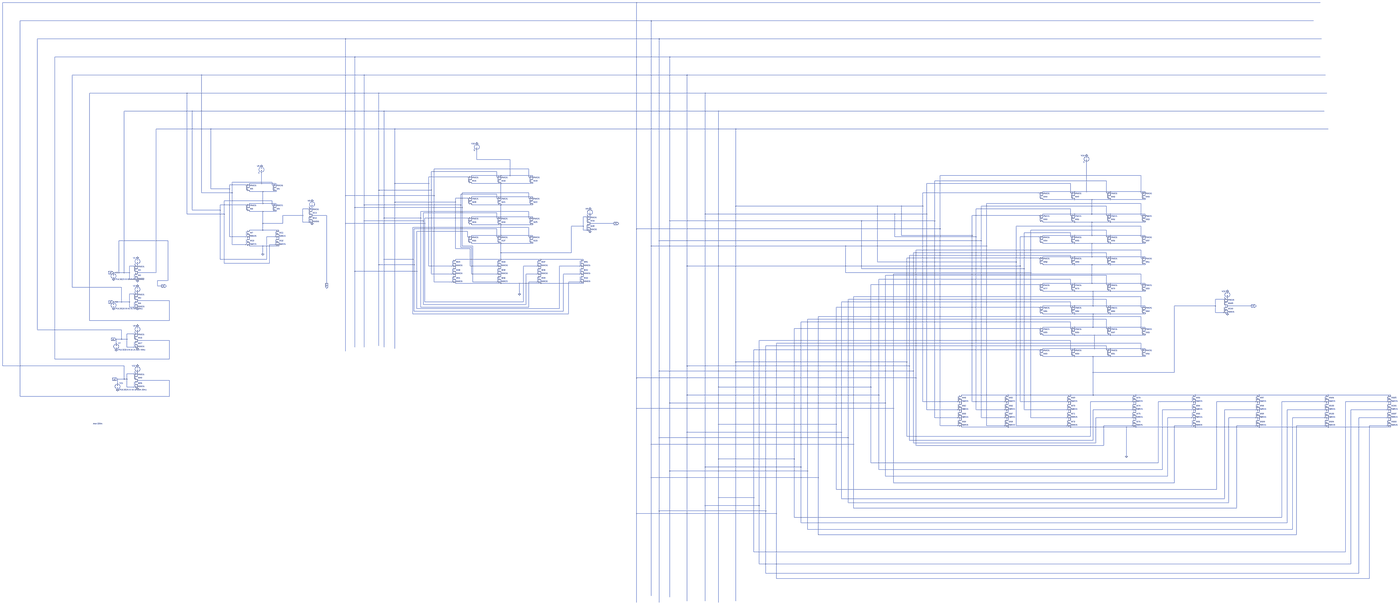
[diagram p0: schematic final using AND,OR.asc, whole sheet]
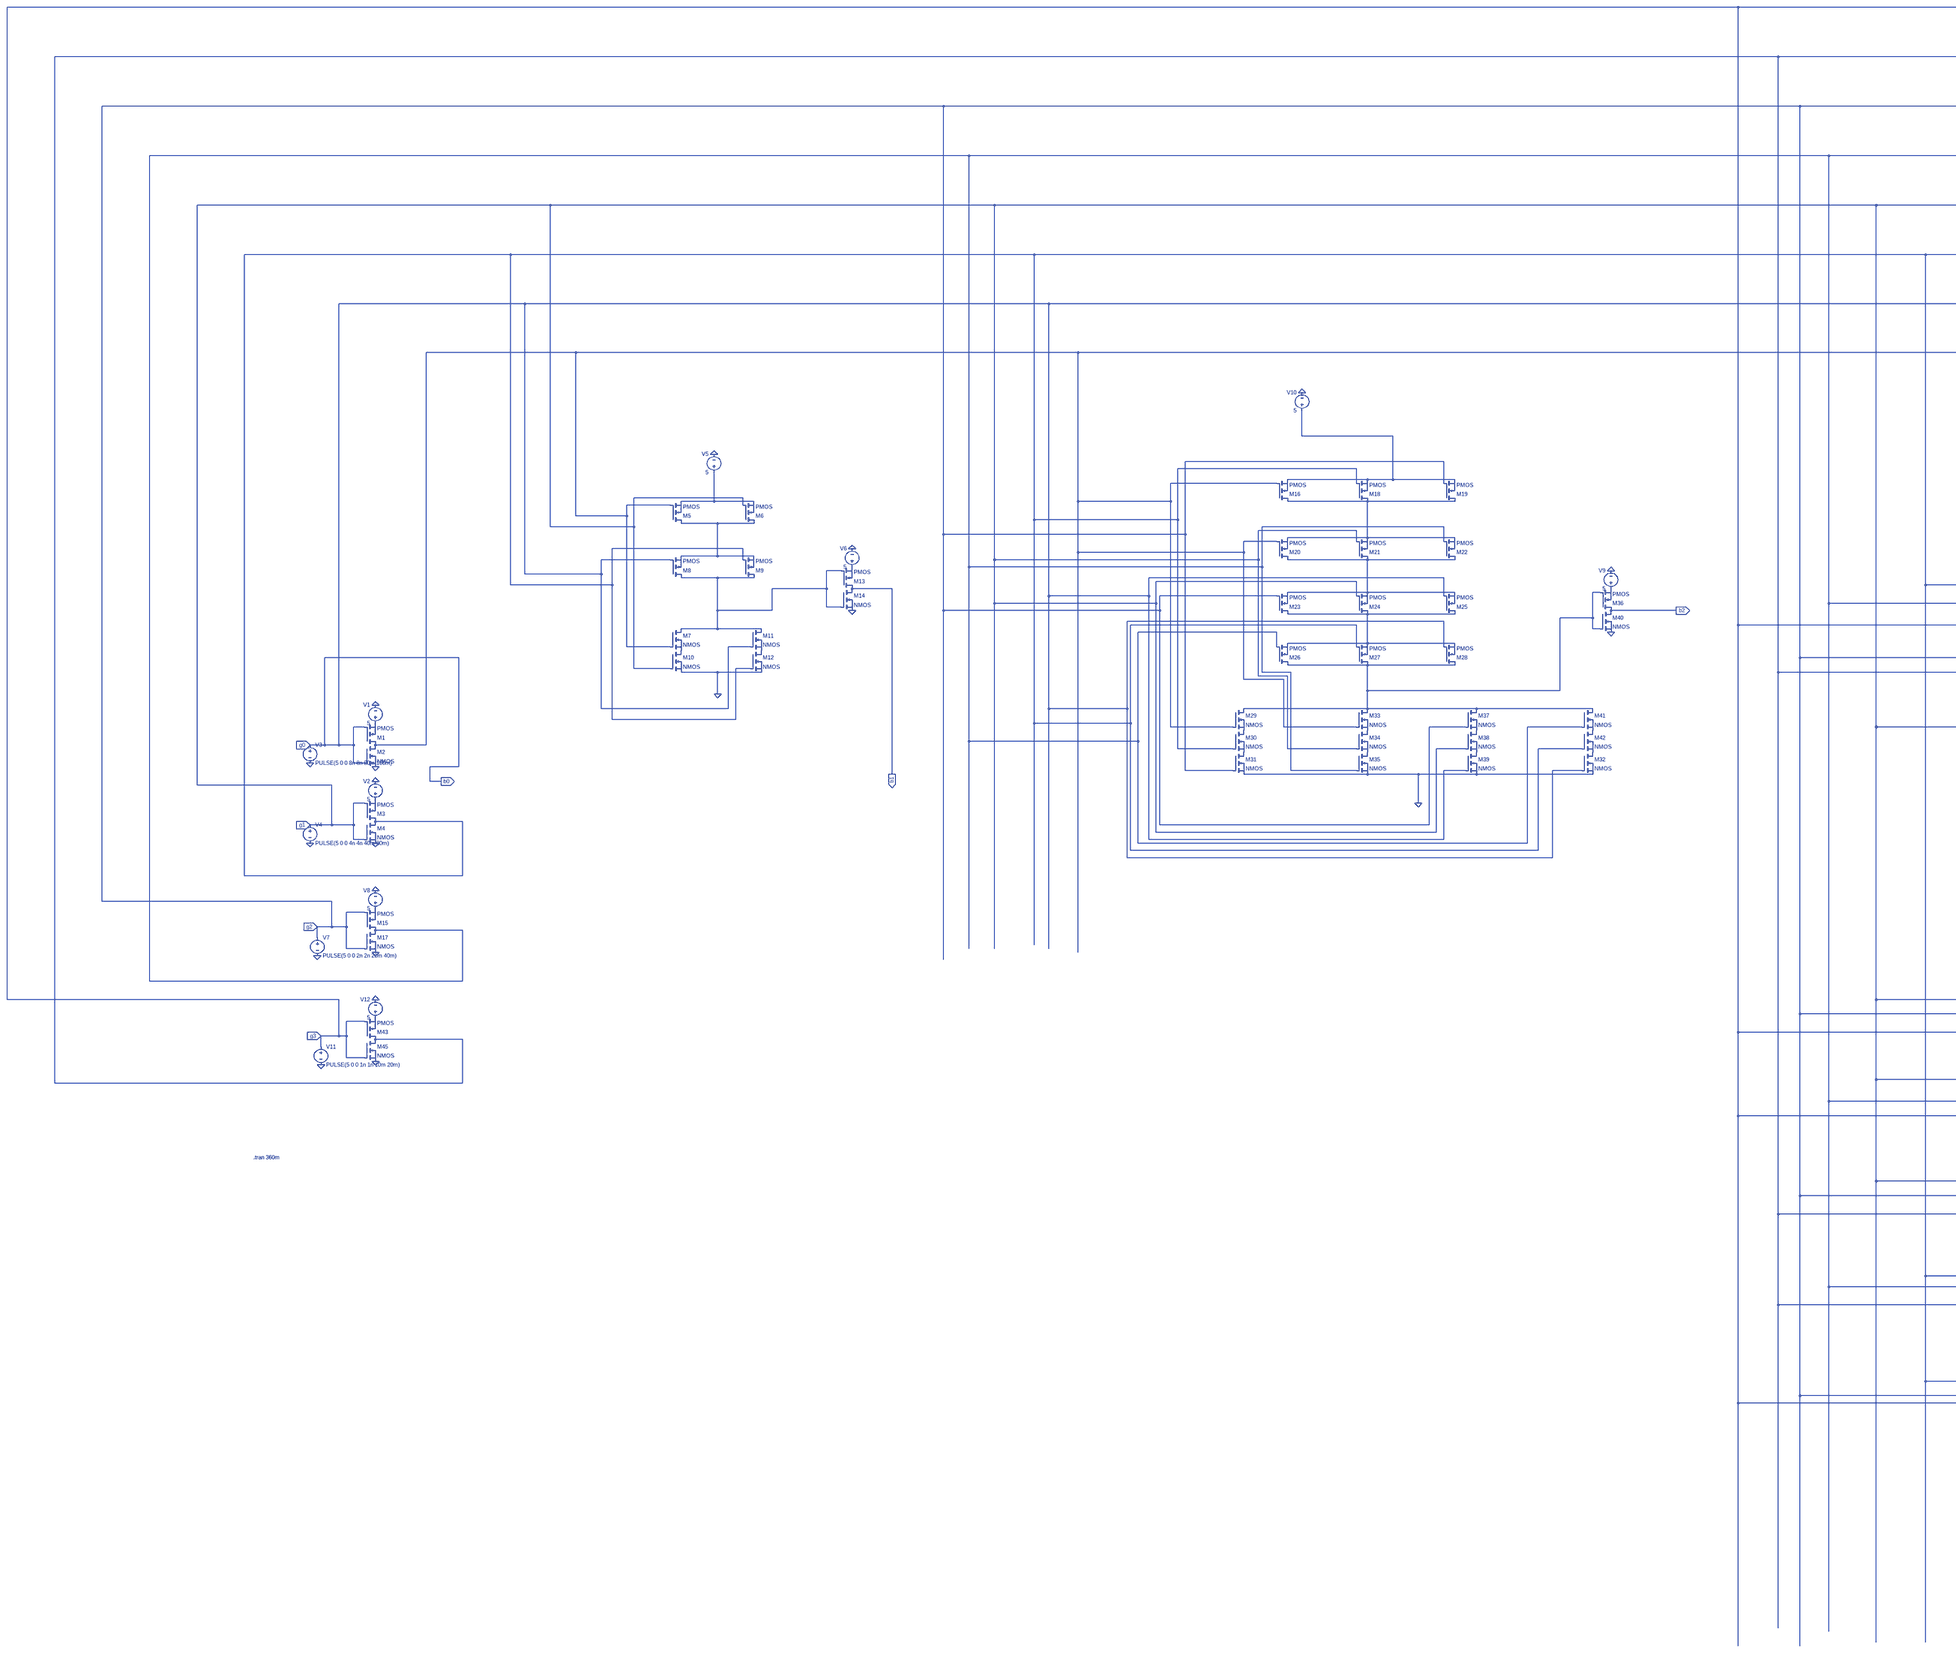
[diagram p1: schematic final using AND,OR.asc, part, row 1 of 1, column 1 of 2]
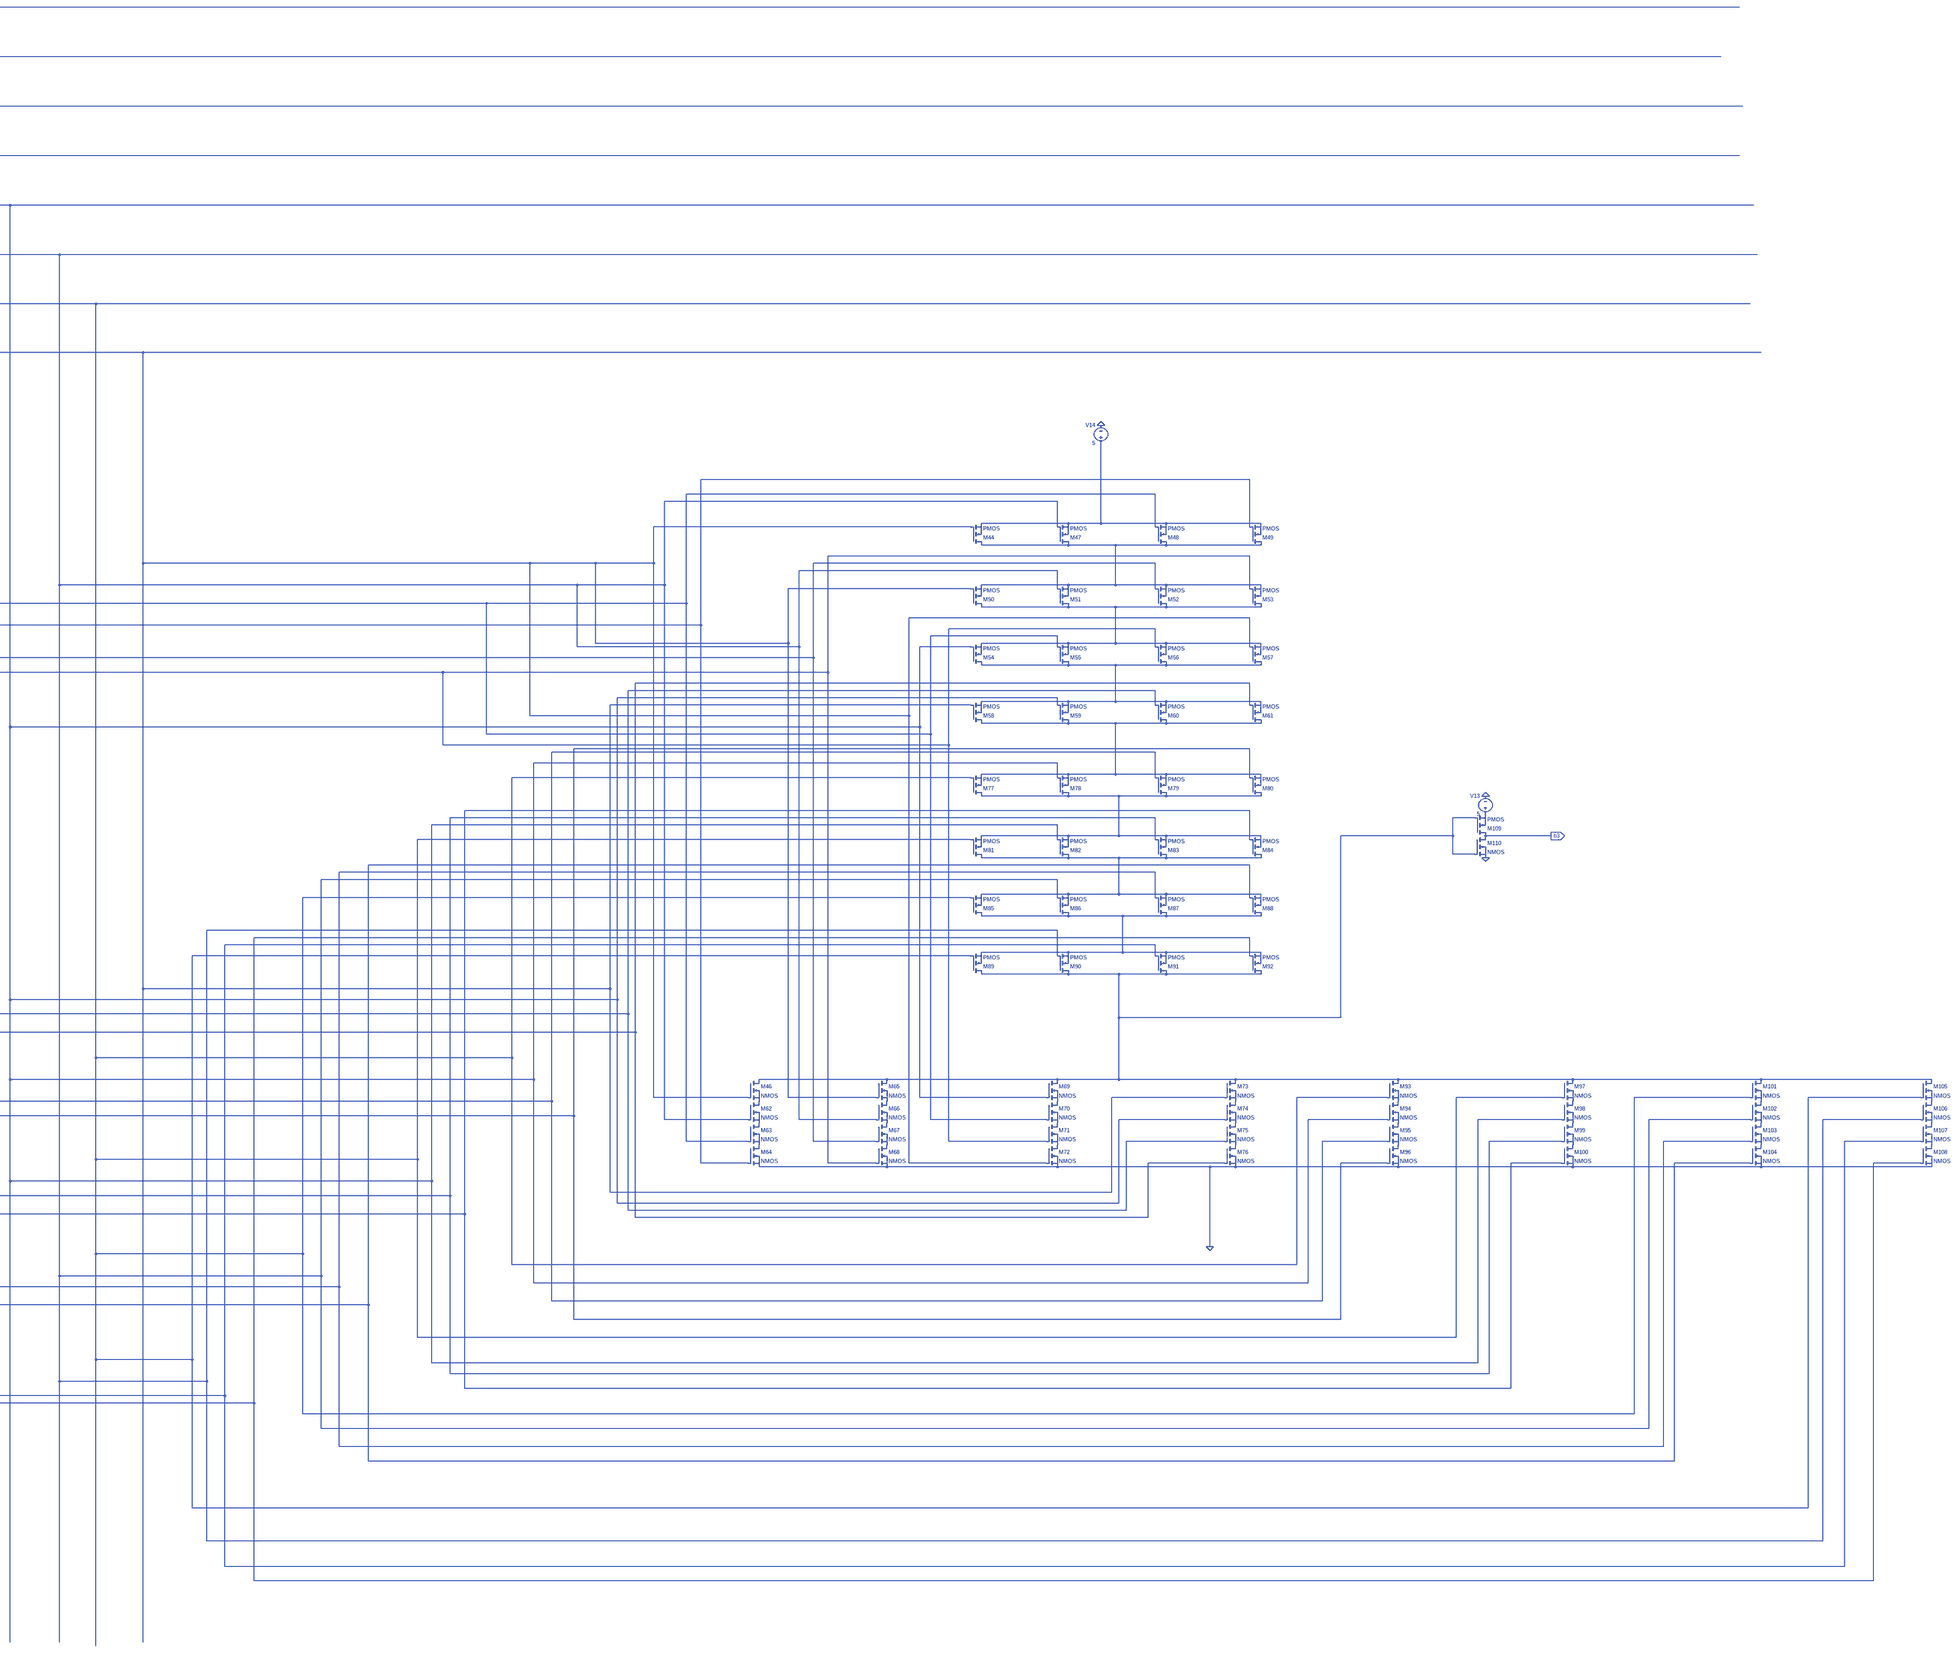
[diagram p2: schematic final using AND,OR.asc, part, row 1 of 1, column 2 of 2]
final using AND,OR.asc, the LTspice schematic file:
Version 4
SHEET 1 18052 4724
WIRE 6912 -4256 -2224 -4256
WIRE 16032 -4256 6912 -4256
WIRE 7088 -3936 -1968 -3936
WIRE 15952 -3936 7088 -3936
WIRE 2816 -3424 -1648 -3424
WIRE 7184 -3424 2816 -3424
WIRE 16048 -3424 7184 -3424
WIRE 2928 -3104 -1408 -3104
WIRE 7312 -3104 2928 -3104
WIRE 16032 -3104 7312 -3104
WIRE 752 -2688 -1136 -2688
WIRE 3040 -2688 752 -2688
WIRE 7520 -2688 3040 -2688
WIRE 16096 -2688 7520 -2688
WIRE 576 -2288 -928 -2288
WIRE 3216 -2288 576 -2288
WIRE 7744 -2288 3216 -2288
WIRE 16112 -2288 7744 -2288
WIRE 640 -1920 -512 -1920
WIRE 3280 -1920 640 -1920
WIRE 7904 -1920 3280 -1920
WIRE 16080 -1920 7904 -1920
WIRE 864 -1680 -128 -1680
WIRE 3408 -1680 864 -1680
WIRE 8112 -1680 3408 -1680
WIRE 16128 -1680 8112 -1680
WIRE 4576 -1312 4576 -1424
WIRE 4976 -1312 4576 -1312
WIRE 5200 -1200 4032 -1200
WIRE 4816 -1168 4000 -1168
WIRE 4864 -1120 4512 -1120
WIRE 4976 -1120 4976 -1312
WIRE 4976 -1120 4864 -1120
WIRE 5248 -1120 4976 -1120
WIRE 13776 -1120 11072 -1120
WIRE 4464 -1104 3968 -1104
WIRE 4816 -1104 4816 -1168
WIRE 5200 -1104 5200 -1200
WIRE 13360 -1056 11008 -1056
WIRE 1600 -1040 1120 -1040
WIRE 1472 -1024 1472 -1152
WIRE 1472 -1024 1328 -1024
WIRE 1648 -1024 1472 -1024
WIRE 3408 -1024 3408 -1680
WIRE 3968 -1024 3968 -1104
WIRE 3968 -1024 3408 -1024
WIRE 4864 -1024 4512 -1024
WIRE 5248 -1024 4864 -1024
WIRE 12928 -1024 10912 -1024
WIRE 1280 -1008 1088 -1008
WIRE 1600 -1008 1600 -1040
WIRE 864 -960 864 -1680
WIRE 1088 -960 1088 -1008
WIRE 1088 -960 864 -960
WIRE 3216 -944 3216 -2288
WIRE 4000 -944 4000 -1168
WIRE 4000 -944 3216 -944
WIRE 1488 -928 1328 -928
WIRE 1648 -928 1488 -928
WIRE 12976 -928 12512 -928
WIRE 13120 -928 13120 -1280
WIRE 13120 -928 12976 -928
WIRE 13408 -928 13120 -928
WIRE 13824 -928 13408 -928
WIRE 752 -912 752 -2688
WIRE 1120 -912 1120 -1040
WIRE 1120 -912 752 -912
WIRE 5200 -912 4400 -912
WIRE 12464 -912 10864 -912
WIRE 12928 -912 12928 -1024
WIRE 13360 -912 13360 -1056
WIRE 13776 -912 13776 -1120
WIRE 4816 -896 4384 -896
WIRE 2816 -880 2816 -3424
WIRE 4032 -880 4032 -1200
WIRE 4032 -880 2816 -880
WIRE 4864 -864 4864 -1024
WIRE 4864 -864 4512 -864
WIRE 5248 -864 4864 -864
WIRE 4464 -848 4320 -848
WIRE 4816 -848 4816 -896
WIRE 5200 -848 5200 -912
WIRE 12976 -832 12512 -832
WIRE 13184 -832 12976 -832
WIRE 13408 -832 13184 -832
WIRE 13824 -832 13408 -832
WIRE 1600 -816 1024 -816
WIRE 3408 -800 3408 -1024
WIRE 4320 -800 4320 -848
WIRE 4320 -800 3408 -800
WIRE 1488 -784 1488 -928
WIRE 1488 -784 1328 -784
WIRE 1648 -784 1488 -784
WIRE 13776 -784 11632 -784
WIRE 1280 -768 976 -768
WIRE 1600 -768 1600 -816
WIRE 3040 -768 3040 -2688
WIRE 4384 -768 4384 -896
WIRE 4384 -768 3040 -768
WIRE 4864 -768 4512 -768
WIRE 5248 -768 4864 -768
WIRE 8112 -752 8112 -1680
WIRE 10320 -752 8112 -752
WIRE 10608 -752 10320 -752
WIRE 10864 -752 10864 -912
WIRE 10864 -752 10608 -752
WIRE 13360 -752 11568 -752
WIRE 2928 -736 2928 -3104
WIRE 4400 -736 4400 -912
WIRE 4400 -736 2928 -736
WIRE 2032 -720 1968 -720
WIRE 12928 -720 11504 -720
WIRE 640 -704 640 -1920
WIRE 976 -704 976 -768
WIRE 976 -704 640 -704
WIRE 1488 -688 1328 -688
WIRE 1648 -688 1488 -688
WIRE 5200 -688 3872 -688
WIRE 4816 -672 3904 -672
WIRE 576 -656 576 -2288
WIRE 1024 -656 1024 -816
WIRE 1024 -656 576 -656
WIRE 7744 -656 7744 -2288
WIRE 10528 -656 7744 -656
WIRE 10912 -656 10912 -1024
WIRE 10912 -656 10528 -656
WIRE 12976 -656 12512 -656
WIRE 13184 -656 13184 -832
WIRE 13184 -656 12976 -656
WIRE 13408 -656 13184 -656
WIRE 13824 -656 13408 -656
WIRE 1968 -640 1968 -720
WIRE 1968 -640 1728 -640
WIRE 2256 -640 2080 -640
WIRE 12464 -640 11456 -640
WIRE 12928 -640 12928 -720
WIRE 13360 -640 13360 -752
WIRE 13776 -640 13776 -784
WIRE 4864 -624 4864 -768
WIRE 4864 -624 4512 -624
WIRE 5248 -624 4864 -624
WIRE 5888 -624 5856 -624
WIRE 3280 -608 3280 -1920
WIRE 3872 -608 3872 -688
WIRE 3872 -608 3280 -608
WIRE 4464 -608 3920 -608
WIRE 4816 -608 4816 -672
WIRE 5200 -608 5200 -688
WIRE 3040 -576 3040 -768
WIRE 3904 -576 3904 -672
WIRE 3904 -576 3040 -576
WIRE 7312 -576 7312 -3104
WIRE 10128 -576 7312 -576
WIRE 11008 -576 11008 -1056
WIRE 11008 -576 10128 -576
WIRE 1968 -560 1968 -640
WIRE 2032 -560 1968 -560
WIRE 12976 -560 12512 -560
WIRE 13184 -560 12976 -560
WIRE 13408 -560 13184 -560
WIRE 13824 -560 13408 -560
WIRE 1488 -544 1488 -688
WIRE 1728 -544 1728 -640
WIRE 1728 -544 1488 -544
WIRE 2816 -544 2816 -880
WIRE 3920 -544 3920 -608
WIRE 3920 -544 2816 -544
WIRE 6480 -544 5936 -544
WIRE 4864 -528 4512 -528
WIRE 5248 -528 4864 -528
WIRE 5856 -512 5856 -624
WIRE 5856 -512 5712 -512
WIRE 13776 -512 12192 -512
WIRE 5200 -496 3776 -496
WIRE 4816 -480 3792 -480
WIRE 6912 -480 6912 -4256
WIRE 11072 -480 11072 -1120
WIRE 11072 -480 6912 -480
WIRE 1488 -464 1488 -544
WIRE 1488 -464 1328 -464
WIRE 1680 -464 1488 -464
WIRE 5856 -464 5856 -512
WIRE 5888 -464 5856 -464
WIRE 13360 -464 12368 -464
WIRE 4464 -448 3824 -448
WIRE 12928 -432 12288 -432
WIRE 4864 -400 4864 -528
WIRE 4864 -400 4512 -400
WIRE 5248 -400 4864 -400
WIRE 10608 -400 10608 -752
WIRE 11456 -400 11456 -640
WIRE 11456 -400 10608 -400
WIRE 12976 -400 12512 -400
WIRE 13184 -400 13184 -560
WIRE 13184 -400 12976 -400
WIRE 13408 -400 13184 -400
WIRE 13824 -400 13408 -400
WIRE 1088 -384 1088 -960
WIRE 1280 -384 1088 -384
WIRE 1632 -384 1536 -384
WIRE 4464 -384 4464 -448
WIRE 4816 -384 4816 -480
WIRE 5200 -384 5200 -496
WIRE 10528 -384 10528 -656
WIRE 11504 -384 11504 -720
WIRE 11504 -384 10528 -384
WIRE 12464 -384 12240 -384
WIRE 12928 -384 12928 -432
WIRE 13360 -384 13360 -464
WIRE 13776 -384 13776 -512
WIRE 16 -336 -576 -336
WIRE 7184 -336 7184 -3424
WIRE 11568 -336 11568 -752
WIRE 11568 -336 7184 -336
WIRE 4864 -304 4512 -304
WIRE 5248 -304 4864 -304
WIRE 12976 -304 12512 -304
WIRE 13184 -304 12976 -304
WIRE 13408 -304 13184 -304
WIRE 13824 -304 13408 -304
WIRE 1120 -288 1120 -912
WIRE 1280 -288 1120 -288
WIRE 1632 -288 1568 -288
WIRE 1488 -272 1328 -272
WIRE 1680 -272 1488 -272
WIRE 4400 -272 4400 -736
WIRE 4528 -272 4400 -272
WIRE 7088 -272 7088 -3936
WIRE 9936 -272 7088 -272
WIRE 11632 -272 11632 -784
WIRE 11632 -272 9936 -272
WIRE 4384 -256 4384 -768
WIRE 4512 -256 4384 -256
WIRE 4320 -240 4320 -800
WIRE 4496 -240 4320 -240
WIRE 13776 -224 10784 -224
WIRE 4864 -192 4864 -304
WIRE 5712 -192 5712 -512
WIRE 5712 -192 4864 -192
WIRE 13360 -192 10752 -192
WIRE 1488 -176 1488 -272
WIRE 12928 -160 10704 -160
WIRE 12976 -144 12512 -144
WIRE 13184 -144 13184 -304
WIRE 13184 -144 12976 -144
WIRE 13408 -144 13184 -144
WIRE 13824 -144 13408 -144
WIRE 12464 -128 10672 -128
WIRE 12928 -128 12928 -160
WIRE 13360 -128 13360 -192
WIRE 13776 -128 13776 -224
WIRE 976 -112 976 -704
WIRE 1536 -112 1536 -384
WIRE 1536 -112 976 -112
WIRE 3280 -112 3280 -608
WIRE 3776 -112 3776 -496
WIRE 3776 -112 3280 -112
WIRE 4864 -112 4864 -192
WIRE 4864 -112 4320 -112
WIRE 5344 -112 4864 -112
WIRE 5856 -112 5344 -112
WIRE 10320 -80 10320 -752
WIRE 12192 -80 12192 -512
WIRE 12192 -80 10320 -80
WIRE 1024 -64 1024 -656
WIRE 1568 -64 1568 -288
WIRE 1568 -64 1024 -64
WIRE 3216 -48 3216 -944
WIRE 3792 -48 3792 -480
WIRE 3792 -48 3216 -48
WIRE 12976 -48 12512 -48
WIRE 13184 -48 12976 -48
WIRE 13408 -48 13184 -48
WIRE 13824 -48 13408 -48
WIRE -400 -32 -448 -32
WIRE 3968 -32 3968 -1024
WIRE 4272 -32 3968 -32
WIRE 4496 -32 4496 -240
WIRE 4816 -32 4496 -32
WIRE 5296 -32 5136 -32
WIRE 5808 -32 5568 -32
WIRE 7520 -32 7520 -2688
WIRE 12240 -32 12240 -384
WIRE 12240 -32 7520 -32
WIRE 10128 0 10128 -576
WIRE 12288 0 12288 -432
WIRE 12288 0 10128 0
WIRE 2928 32 2928 -736
WIRE 3824 32 3824 -448
WIRE 3824 32 2928 32
WIRE -576 48 -576 -336
WIRE -576 48 -640 48
WIRE -512 48 -512 -1920
WIRE -512 48 -576 48
WIRE -448 48 -448 -32
WIRE -448 48 -512 48
WIRE -128 48 -128 -1680
WIRE -128 48 -352 48
WIRE 9936 48 9936 -272
WIRE 12368 48 12368 -464
WIRE 12368 48 9936 48
WIRE 4000 64 4000 -944
WIRE 4272 64 4000 64
WIRE 4512 64 4512 -256
WIRE 4816 64 4512 64
WIRE 5296 64 5168 64
WIRE 5808 64 5616 64
WIRE 13776 64 10512 64
WIRE 13360 80 10416 80
WIRE -448 128 -448 48
WIRE -400 128 -448 128
WIRE 12928 128 10336 128
WIRE 16 144 16 -336
WIRE 16 144 -112 144
WIRE 4032 160 4032 -880
WIRE 4272 160 4032 160
WIRE 4528 160 4528 -272
WIRE 4816 160 4528 160
WIRE 5296 160 5200 160
WIRE 5808 160 5680 160
WIRE 2256 176 2256 -640
WIRE 4864 176 4320 176
WIRE 5088 176 4864 176
WIRE 5344 176 5088 176
WIRE 5856 176 5344 176
WIRE 12976 176 12512 176
WIRE 13184 176 13184 -48
WIRE 13184 176 12976 176
WIRE 13408 176 13184 176
WIRE 13824 176 13408 176
WIRE 12464 192 10240 192
WIRE 12928 192 12928 128
WIRE 13360 192 13360 80
WIRE 13776 192 13776 64
WIRE -112 208 -112 144
WIRE -64 208 -112 208
WIRE -1136 224 -1136 -2688
WIRE -544 224 -1136 224
WIRE 12976 272 12512 272
WIRE 13200 272 12976 272
WIRE 13408 272 13200 272
WIRE 13824 272 13408 272
WIRE -400 304 -448 304
WIRE 5088 304 5088 176
WIRE 13776 336 10032 336
WIRE 13360 368 9968 368
WIRE 14864 368 14768 368
WIRE 32 384 -352 384
WIRE -544 400 -544 224
WIRE -544 400 -640 400
WIRE -448 400 -448 304
WIRE -448 400 -544 400
WIRE 3920 400 3920 -544
WIRE 5136 400 5136 -32
WIRE 5136 400 3920 400
WIRE 12928 400 9888 400
WIRE 3904 432 3904 -576
WIRE 5168 432 5168 64
WIRE 5168 432 3904 432
WIRE 12976 448 12512 448
WIRE 13200 448 13200 272
WIRE 13200 448 12976 448
WIRE 13408 448 13200 448
WIRE 13824 448 13408 448
WIRE 14768 448 14768 368
WIRE 14768 448 14176 448
WIRE 15200 448 14912 448
WIRE -448 464 -448 400
WIRE -400 464 -448 464
WIRE 3872 464 3872 -608
WIRE 5200 464 5200 160
WIRE 5200 464 3872 464
WIRE 12464 464 9824 464
WIRE 12928 464 12928 400
WIRE 13360 464 13360 368
WIRE 13776 464 13776 336
WIRE 3824 480 3824 32
WIRE 5568 480 5568 -32
WIRE 5568 480 3824 480
WIRE 3792 512 3792 -48
WIRE 5616 512 5616 64
WIRE 5616 512 3792 512
WIRE 14768 528 14768 448
WIRE 14864 528 14768 528
WIRE 3776 544 3776 -112
WIRE 5680 544 5680 160
WIRE 5680 544 3776 544
WIRE 12976 544 12512 544
WIRE 13200 544 12976 544
WIRE 13408 544 13200 544
WIRE 13824 544 13408 544
WIRE 13776 576 9456 576
WIRE 13360 608 9328 608
WIRE -928 624 -928 -2288
WIRE 32 624 32 384
WIRE 32 624 -928 624
WIRE 12928 640 9248 640
WIRE 12976 704 12512 704
WIRE 13200 704 13200 544
WIRE 13200 704 12976 704
WIRE 13408 704 13200 704
WIRE 13824 704 13408 704
WIRE 12464 720 9168 720
WIRE 12928 720 12928 640
WIRE 13360 720 13360 608
WIRE 13776 720 13776 576
WIRE -1648 736 -1648 -3424
WIRE -544 736 -1648 736
WIRE -400 784 -480 784
WIRE 12976 800 12512 800
WIRE 13216 800 12976 800
WIRE 13408 800 13216 800
WIRE 13824 800 13408 800
WIRE -544 848 -544 736
WIRE -544 848 -608 848
WIRE -480 848 -480 784
WIRE -480 848 -544 848
WIRE 32 864 -352 864
WIRE 12928 864 8656 864
WIRE -608 896 -608 848
WIRE 13776 896 8864 896
WIRE 3216 928 3216 -48
WIRE 13360 928 8736 928
WIRE -480 944 -480 848
WIRE -400 944 -480 944
WIRE 2928 944 2928 32
WIRE 3040 944 3040 -576
WIRE 3280 944 3280 -112
WIRE 3408 960 3408 -800
WIRE 12976 960 12512 960
WIRE 13216 960 13216 800
WIRE 13216 960 12976 960
WIRE 13408 960 13216 960
WIRE 13824 960 13408 960
WIRE 12464 976 8592 976
WIRE 12928 976 12928 864
WIRE 13360 976 13360 928
WIRE 13776 976 13776 896
WIRE 2816 992 2816 -544
WIRE 12976 1056 12512 1056
WIRE 13200 1056 12976 1056
WIRE 13408 1056 13200 1056
WIRE 13824 1056 13408 1056
WIRE -1408 1088 -1408 -3104
WIRE 32 1088 32 864
WIRE 32 1088 -1408 1088
WIRE 8112 1120 8112 -752
WIRE 10672 1120 10672 -128
WIRE 10672 1120 8112 1120
WIRE -2224 1168 -2224 -4256
WIRE -512 1168 -2224 1168
WIRE 7520 1168 7520 -32
WIRE 10704 1168 10704 -160
WIRE 10704 1168 7520 1168
WIRE 7184 1232 7184 -336
WIRE 10752 1232 10752 -192
WIRE 10752 1232 7184 1232
WIRE 13200 1248 13200 1056
WIRE 14176 1248 14176 448
WIRE 14176 1248 13200 1248
WIRE -400 1264 -480 1264
WIRE 6912 1312 6912 -480
WIRE 10784 1312 10784 -224
WIRE 10784 1312 6912 1312
WIRE -512 1328 -512 1168
WIRE -512 1328 -592 1328
WIRE -480 1328 -480 1264
WIRE -480 1328 -512 1328
WIRE 32 1344 -352 1344
WIRE -592 1376 -592 1328
WIRE -480 1424 -480 1328
WIRE -400 1424 -480 1424
WIRE 7904 1424 7904 -1920
WIRE 10240 1424 10240 192
WIRE 10240 1424 7904 1424
WIRE 7520 1520 7520 1168
WIRE 10336 1520 10336 128
WIRE 10336 1520 7520 1520
WIRE 12096 1520 11328 1520
WIRE 12928 1520 12096 1520
WIRE 13200 1520 13200 1248
WIRE 13200 1520 12928 1520
WIRE 13712 1520 13200 1520
WIRE 14528 1520 13712 1520
WIRE 15296 1520 14528 1520
WIRE 16128 1520 15296 1520
WIRE 16912 1520 16128 1520
WIRE -1968 1536 -1968 -3936
WIRE 32 1536 32 1344
WIRE 32 1536 -1968 1536
WIRE 10864 1600 10864 -752
WIRE 11280 1600 10864 1600
WIRE 11456 1600 11456 -400
WIRE 12048 1600 11456 1600
WIRE 12240 1600 12240 -32
WIRE 12880 1600 12240 1600
WIRE 13664 1600 13168 1600
WIRE 14480 1600 13984 1600
WIRE 15248 1600 14784 1600
WIRE 16080 1600 15568 1600
WIRE 16864 1600 16336 1600
WIRE 7312 1616 7312 -576
WIRE 10416 1616 10416 80
WIRE 10416 1616 7312 1616
WIRE 6912 1680 6912 1312
WIRE 10512 1680 10512 64
WIRE 10512 1680 6912 1680
WIRE 10912 1696 10912 -656
WIRE 11280 1696 10912 1696
WIRE 11504 1696 11504 -384
WIRE 12048 1696 11504 1696
WIRE 12288 1696 12288 0
WIRE 12880 1696 12288 1696
WIRE 13664 1696 13200 1696
WIRE 14480 1696 14032 1696
WIRE 15248 1696 14880 1696
WIRE 16080 1696 15632 1696
WIRE 16864 1696 16400 1696
WIRE 11008 1792 11008 -576
WIRE 11280 1792 11008 1792
WIRE 11568 1792 11568 -336
WIRE 12048 1792 11568 1792
WIRE 12368 1792 12368 48
WIRE 12880 1792 12368 1792
WIRE 13664 1792 13232 1792
WIRE 14480 1792 14096 1792
WIRE 15248 1792 14928 1792
WIRE 16080 1792 15696 1792
WIRE 16864 1792 16496 1792
WIRE 7904 1872 7904 1424
WIRE 9824 1872 9824 464
WIRE 9824 1872 7904 1872
WIRE 11072 1888 11072 -480
WIRE 11280 1888 11072 1888
WIRE 11632 1888 11632 -272
WIRE 12048 1888 11632 1888
WIRE 12192 1888 12192 -80
WIRE 12880 1888 12192 1888
WIRE 13664 1888 13328 1888
WIRE 14480 1888 14176 1888
WIRE 15248 1888 15024 1888
WIRE 16080 1888 15744 1888
WIRE 16864 1888 16624 1888
WIRE 12096 1904 11328 1904
WIRE 12928 1904 12096 1904
WIRE 13600 1904 12928 1904
WIRE 13712 1904 13600 1904
WIRE 14528 1904 13712 1904
WIRE 15296 1904 14528 1904
WIRE 16128 1904 15296 1904
WIRE 16912 1904 16128 1904
WIRE 7520 1968 7520 1520
WIRE 9888 1968 9888 400
WIRE 9888 1968 7520 1968
WIRE 10672 2016 10672 1120
WIRE 13168 2016 13168 1600
WIRE 13168 2016 10672 2016
WIRE 7184 2032 7184 1232
WIRE 9968 2032 9968 368
WIRE 9968 2032 7184 2032
WIRE 10704 2064 10704 1168
WIRE 13200 2064 13200 1696
WIRE 13200 2064 10704 2064
WIRE 10752 2096 10752 1232
WIRE 13232 2096 13232 1792
WIRE 13232 2096 10752 2096
WIRE 7088 2112 7088 -272
WIRE 10032 2112 10032 336
WIRE 10032 2112 7088 2112
WIRE 10784 2128 10784 1312
WIRE 13328 2128 13328 1888
WIRE 13328 2128 10784 2128
WIRE 13600 2256 13600 1904
WIRE 7904 2288 7904 1872
WIRE 9168 2288 9168 720
WIRE 9168 2288 7904 2288
WIRE 10240 2336 10240 1424
WIRE 13984 2336 13984 1600
WIRE 13984 2336 10240 2336
WIRE 7744 2384 7744 -656
WIRE 9248 2384 9248 640
WIRE 9248 2384 7744 2384
WIRE 10336 2416 10336 1520
WIRE 14032 2416 14032 1696
WIRE 14032 2416 10336 2416
WIRE 7312 2432 7312 1616
WIRE 9328 2432 9328 608
WIRE 9328 2432 7312 2432
WIRE 10416 2496 10416 1616
WIRE 14096 2496 14096 1792
WIRE 14096 2496 10416 2496
WIRE 7088 2512 7088 2112
WIRE 9456 2512 9456 576
WIRE 9456 2512 7088 2512
WIRE 10512 2576 10512 1680
WIRE 14176 2576 14176 1888
WIRE 14176 2576 10512 2576
WIRE 9824 2656 9824 1872
WIRE 14784 2656 14784 1600
WIRE 14784 2656 9824 2656
WIRE 7904 2752 7904 2288
WIRE 8592 2752 8592 976
WIRE 8592 2752 7904 2752
WIRE 9888 2768 9888 1968
WIRE 14880 2768 14880 1696
WIRE 14880 2768 9888 2768
WIRE 9968 2816 9968 2032
WIRE 14928 2816 14928 1792
WIRE 14928 2816 9968 2816
WIRE 7744 2848 7744 2384
WIRE 8656 2848 8656 864
WIRE 8656 2848 7744 2848
WIRE 10032 2880 10032 2112
WIRE 15024 2880 15024 1888
WIRE 15024 2880 10032 2880
WIRE 7184 2912 7184 2032
WIRE 8736 2912 8736 928
WIRE 8736 2912 7184 2912
WIRE 6912 2944 6912 1680
WIRE 8864 2944 8864 896
WIRE 8864 2944 6912 2944
WIRE 9168 2992 9168 2288
WIRE 15568 2992 15568 1600
WIRE 15568 2992 9168 2992
WIRE 9248 3056 9248 2384
WIRE 15632 3056 15632 1696
WIRE 15632 3056 9248 3056
WIRE 9328 3136 9328 2432
WIRE 15696 3136 15696 1792
WIRE 15696 3136 9328 3136
WIRE 9456 3200 9456 2512
WIRE 15744 3200 15744 1888
WIRE 15744 3200 9456 3200
WIRE 8592 3440 8592 2752
WIRE 16336 3440 16336 1600
WIRE 16336 3440 8592 3440
WIRE 8656 3584 8656 2848
WIRE 16400 3584 16400 1696
WIRE 16400 3584 8656 3584
WIRE 8736 3696 8736 2912
WIRE 16496 3696 16496 1792
WIRE 16496 3696 8736 3696
WIRE 8864 3760 8864 2944
WIRE 16624 3760 16624 1888
WIRE 16624 3760 8864 3760
WIRE 7088 4640 7088 2512
WIRE 7312 4656 7312 2432
WIRE 7520 4704 7520 1968
WIRE 7744 4704 7744 2848
WIRE 8112 4704 8112 1120
WIRE 6912 4720 6912 2944
WIRE 7184 4720 7184 2912
WIRE 7904 4720 7904 2752
FLAG -352 144 0
FLAG -352 480 0
FLAG -352 -128 0
FLAG -352 208 0
FLAG -640 128 0
FLAG -640 480 0
FLAG 1488 -176 0
FLAG 2080 -816 0
FLAG 2080 -544 0
FLAG -608 976 0
FLAG -352 688 0
FLAG -352 960 0
FLAG 5088 304 0
FLAG 5936 -448 0
FLAG 5936 -720 0
FLAG -592 1456 0
FLAG -352 1168 0
FLAG -352 1440 0
FLAG 13600 2256 0
FLAG 14912 272 0
FLAG 14912 544 0
FLAG 4576 -1504 0
FLAG 13120 -1360 0
FLAG 1472 -1232 0
FLAG 2256 176 b1
IOPIN 2256 176 Out
FLAG 6480 -544 b2
IOPIN 6480 -544 Out
FLAG 15200 448 b3
IOPIN 15200 448 Out
FLAG -640 48 g0
IOPIN -640 48 In
FLAG -640 400 g1
IOPIN -640 400 In
FLAG -608 848 g2
IOPIN -608 848 In
FLAG -592 1328 g3
IOPIN -592 1328 In
FLAG -64 208 b0
IOPIN -64 208 Out
SYMBOL pmos -400 48 M180
SYMATTR InstName M1
SYMBOL nmos -400 48 R0
SYMATTR InstName M2
SYMBOL pmos -400 384 M180
SYMATTR InstName M3
SYMBOL nmos -400 384 R0
SYMATTR InstName M4
SYMBOL voltage -352 -32 R180
WINDOW 0 24 96 Left 2
WINDOW 3 24 16 Left 2
WINDOW 123 0 0 Left 0
WINDOW 39 0 0 Left 0
SYMATTR InstName V1
SYMATTR Value 5
SYMBOL voltage -352 304 R180
WINDOW 0 24 96 Left 2
WINDOW 3 24 16 Left 2
WINDOW 123 0 0 Left 0
WINDOW 39 0 0 Left 0
SYMATTR InstName V2
SYMATTR Value 5
SYMBOL voltage -640 32 R0
WINDOW 123 0 0 Left 0
WINDOW 39 0 0 Left 0
SYMATTR InstName V3
SYMATTR Value PULSE(5 0 0 8n 8n 80m 160m)
SYMBOL voltage -640 384 R0
WINDOW 123 0 0 Left 0
WINDOW 39 0 0 Left 0
SYMATTR InstName V4
SYMATTR Value PULSE(5 0 0 4n 4n 40m 80m)
SYMBOL pmos 1280 -928 M180
SYMATTR InstName M5
SYMBOL pmos 1600 -928 M180
SYMATTR InstName M6
SYMBOL pmos 1280 -688 M180
SYMATTR InstName M8
SYMBOL pmos 1600 -688 M180
SYMATTR InstName M9
SYMBOL nmos 1280 -464 R0
SYMATTR InstName M7
SYMBOL nmos 1280 -368 R0
SYMATTR InstName M10
SYMBOL nmos 1632 -464 R0
SYMATTR InstName M11
SYMBOL pmos 2032 -640 M180
SYMATTR InstName M13
SYMBOL nmos 2032 -640 R0
SYMATTR InstName M14
SYMBOL voltage 2080 -720 R180
WINDOW 0 24 96 Left 2
WINDOW 3 24 16 Left 2
WINDOW 123 0 0 Left 0
WINDOW 39 0 0 Left 0
SYMATTR InstName V6
SYMATTR Value 5
SYMBOL pmos -400 864 M180
SYMATTR InstName M15
SYMBOL pmos 4464 -1024 M180
SYMATTR InstName M16
SYMBOL nmos -400 864 R0
SYMATTR InstName M17
SYMBOL voltage -608 880 R0
WINDOW 123 0 0 Left 0
WINDOW 39 0 0 Left 0
SYMATTR InstName V7
SYMATTR Value PULSE(5 0 0 2n 2n 20m 40m)
SYMBOL voltage -352 784 R180
WINDOW 0 24 96 Left 2
WINDOW 3 24 16 Left 2
WINDOW 123 0 0 Left 0
WINDOW 39 0 0 Left 0
SYMATTR InstName V8
SYMATTR Value 5
SYMBOL pmos 4816 -1024 M180
SYMATTR InstName M18
SYMBOL pmos 5200 -1024 M180
SYMATTR InstName M19
SYMBOL pmos 4464 -768 M180
SYMATTR InstName M20
SYMBOL pmos 4816 -768 M180
SYMATTR InstName M21
SYMBOL pmos 5200 -768 M180
SYMATTR InstName M22
SYMBOL pmos 4464 -528 M180
SYMATTR InstName M23
SYMBOL pmos 4816 -528 M180
SYMATTR InstName M24
SYMBOL pmos 5200 -528 M180
SYMATTR InstName M25
SYMBOL pmos 4464 -304 M180
SYMATTR InstName M26
SYMBOL pmos 4816 -304 M180
SYMATTR InstName M27
SYMBOL pmos 5200 -304 M180
SYMATTR InstName M28
SYMBOL nmos 4272 -112 R0
SYMATTR InstName M29
SYMBOL nmos 4272 -16 R0
SYMATTR InstName M30
SYMBOL nmos 4272 80 R0
SYMATTR InstName M31
SYMBOL nmos 4816 -112 R0
SYMATTR InstName M33
SYMBOL nmos 4816 -16 R0
SYMATTR InstName M34
SYMBOL nmos 4816 80 R0
SYMATTR InstName M35
SYMBOL nmos 5296 -112 R0
SYMATTR InstName M37
SYMBOL nmos 5296 -16 R0
SYMATTR InstName M38
SYMBOL nmos 5296 80 R0
SYMATTR InstName M39
SYMBOL nmos 5808 -112 R0
SYMATTR InstName M41
SYMBOL nmos 5808 -16 R0
SYMATTR InstName M42
SYMBOL nmos 5808 80 R0
SYMATTR InstName M32
SYMBOL pmos 5888 -544 M180
SYMATTR InstName M36
SYMBOL nmos 5888 -544 R0
SYMATTR InstName M40
SYMBOL voltage 5936 -624 R180
WINDOW 0 24 96 Left 2
WINDOW 3 24 16 Left 2
WINDOW 123 0 0 Left 0
WINDOW 39 0 0 Left 0
SYMATTR InstName V9
SYMATTR Value 5
SYMBOL pmos -400 1344 M180
SYMATTR InstName M43
SYMBOL pmos 12464 -832 M180
SYMATTR InstName M44
SYMBOL nmos -400 1344 R0
SYMATTR InstName M45
SYMBOL nmos 11280 1520 R0
SYMATTR InstName M46
SYMBOL voltage -592 1360 R0
WINDOW 123 0 0 Left 0
WINDOW 39 0 0 Left 0
SYMATTR InstName V11
SYMATTR Value PULSE(5 0 0 1n 1n 10m 20m)
SYMBOL voltage -352 1264 R180
WINDOW 0 24 96 Left 2
WINDOW 3 24 16 Left 2
WINDOW 123 0 0 Left 0
WINDOW 39 0 0 Left 0
SYMATTR InstName V12
SYMATTR Value 5
SYMBOL pmos 12928 -832 M180
SYMATTR InstName M47
SYMBOL pmos 13360 -832 M180
SYMATTR InstName M48
SYMBOL pmos 13776 -832 M180
SYMATTR InstName M49
SYMBOL pmos 12464 -560 M180
SYMATTR InstName M50
SYMBOL pmos 12928 -560 M180
SYMATTR InstName M51
SYMBOL pmos 13360 -560 M180
SYMATTR InstName M52
SYMBOL pmos 13776 -560 M180
SYMATTR InstName M53
SYMBOL pmos 12464 -304 M180
SYMATTR InstName M54
SYMBOL pmos 12928 -304 M180
SYMATTR InstName M55
SYMBOL pmos 13360 -304 M180
SYMATTR InstName M56
SYMBOL pmos 13776 -304 M180
SYMATTR InstName M57
SYMBOL pmos 12464 -48 M180
SYMATTR InstName M58
SYMBOL pmos 12928 -48 M180
SYMATTR InstName M59
SYMBOL pmos 13360 -48 M180
SYMATTR InstName M60
SYMBOL pmos 13776 -48 M180
SYMATTR InstName M61
SYMBOL nmos 11280 1616 R0
SYMATTR InstName M62
SYMBOL nmos 11280 1712 R0
SYMATTR InstName M63
SYMBOL nmos 11280 1808 R0
SYMATTR InstName M64
SYMBOL nmos 12048 1520 R0
SYMATTR InstName M65
SYMBOL nmos 12048 1616 R0
SYMATTR InstName M66
SYMBOL nmos 12048 1712 R0
SYMATTR InstName M67
SYMBOL nmos 12048 1808 R0
SYMATTR InstName M68
SYMBOL nmos 12880 1520 R0
SYMATTR InstName M69
SYMBOL nmos 12880 1616 R0
SYMATTR InstName M70
SYMBOL nmos 12880 1712 R0
SYMATTR InstName M71
SYMBOL nmos 12880 1808 R0
SYMATTR InstName M72
SYMBOL nmos 13664 1520 R0
SYMATTR InstName M73
SYMBOL nmos 13664 1616 R0
SYMATTR InstName M74
SYMBOL nmos 13664 1712 R0
SYMATTR InstName M75
SYMBOL nmos 13664 1808 R0
SYMATTR InstName M76
SYMBOL pmos 12464 272 M180
SYMATTR InstName M77
SYMBOL pmos 12928 272 M180
SYMATTR InstName M78
SYMBOL pmos 13360 272 M180
SYMATTR InstName M79
SYMBOL pmos 13776 272 M180
SYMATTR InstName M80
SYMBOL pmos 12464 544 M180
SYMATTR InstName M81
SYMBOL pmos 12928 544 M180
SYMATTR InstName M82
SYMBOL pmos 13360 544 M180
SYMATTR InstName M83
SYMBOL pmos 13776 544 M180
SYMATTR InstName M84
SYMBOL pmos 12464 800 M180
SYMATTR InstName M85
SYMBOL pmos 12928 800 M180
SYMATTR InstName M86
SYMBOL pmos 13360 800 M180
SYMATTR InstName M87
SYMBOL pmos 13776 800 M180
SYMATTR InstName M88
SYMBOL pmos 12464 1056 M180
SYMATTR InstName M89
SYMBOL pmos 12928 1056 M180
SYMATTR InstName M90
SYMBOL pmos 13360 1056 M180
SYMATTR InstName M91
SYMBOL pmos 13776 1056 M180
SYMATTR InstName M92
SYMBOL nmos 14480 1520 R0
SYMATTR InstName M93
SYMBOL nmos 14480 1616 R0
SYMATTR InstName M94
SYMBOL nmos 14480 1712 R0
SYMATTR InstName M95
SYMBOL nmos 14480 1808 R0
SYMATTR InstName M96
SYMBOL nmos 15248 1520 R0
SYMATTR InstName M97
SYMBOL nmos 15248 1616 R0
SYMATTR InstName M98
SYMBOL nmos 15248 1712 R0
SYMATTR InstName M99
SYMBOL nmos 15248 1808 R0
SYMATTR InstName M100
SYMBOL nmos 16080 1520 R0
SYMATTR InstName M101
SYMBOL nmos 16080 1616 R0
SYMATTR InstName M102
SYMBOL nmos 16080 1712 R0
SYMATTR InstName M103
SYMBOL nmos 16080 1808 R0
SYMATTR InstName M104
SYMBOL nmos 16864 1520 R0
SYMATTR InstName M105
SYMBOL nmos 16864 1616 R0
SYMATTR InstName M106
SYMBOL nmos 16864 1712 R0
SYMATTR InstName M107
SYMBOL nmos 16864 1808 R0
SYMATTR InstName M108
SYMBOL pmos 14864 448 M180
SYMATTR InstName M109
SYMBOL nmos 14864 448 R0
SYMATTR InstName M110
SYMBOL voltage 14912 368 R180
WINDOW 0 24 96 Left 2
WINDOW 3 24 16 Left 2
WINDOW 123 0 0 Left 0
WINDOW 39 0 0 Left 0
SYMATTR InstName V13
SYMATTR Value 5
SYMBOL voltage 4576 -1408 R180
WINDOW 0 24 96 Left 2
WINDOW 3 24 16 Left 2
WINDOW 123 0 0 Left 0
WINDOW 39 0 0 Left 0
SYMATTR InstName V10
SYMATTR Value 5
SYMBOL voltage 1472 -1136 R180
WINDOW 0 24 96 Left 2
WINDOW 3 24 16 Left 2
WINDOW 123 0 0 Left 0
WINDOW 39 0 0 Left 0
SYMATTR InstName V5
SYMATTR Value 5
SYMBOL voltage 13120 -1264 R180
WINDOW 0 24 96 Left 2
WINDOW 3 24 16 Left 2
WINDOW 123 0 0 Left 0
WINDOW 39 0 0 Left 0
SYMATTR InstName V14
SYMATTR Value 5
SYMBOL nmos 1632 -368 R0
SYMATTR InstName M12
TEXT -888 1864 Left 2 !.tran 360m

The netlist it stands for:
* final using AND,OR.asc
M1 N004 b0 P001 P001 PMOS
M2 N004 b0 0 0 NMOS
M3 N003 g1 P002 P002 PMOS
M4 N003 g1 0 0 NMOS
V1 P001 0 5
V2 P002 0 5
V3 b0 0 PULSE(5 0 0 8n 8n 80m 160m)
V4 g1 0 PULSE(5 0 0 4n 4n 40m 80m)
M5 N008 N004 N006 N006 PMOS
M6 N008 g1 N006 N006 PMOS
M8 N012 b0 N008 N008 PMOS
M9 N012 N003 N008 N008 PMOS
M7 N012 N004 P003 P003 NMOS
M10 P003 g1 0 0 NMOS
M11 N012 b0 P004 P004 NMOS
M13 b1 N012 P005 P005 PMOS
M14 b1 N012 0 0 NMOS
V6 P005 0 5
M15 N002 g2 P006 P006 PMOS
M16 N007 N004 N005 N005 PMOS
M17 N002 g2 0 0 NMOS
V7 g2 0 PULSE(5 0 0 2n 2n 20m 40m)
V8 P006 0 5
M18 N007 N003 N005 N005 PMOS
M19 N007 g2 N005 N005 PMOS
M20 N011 N004 N007 N007 PMOS
M21 N011 g1 N007 N007 PMOS
M22 N011 N002 N007 N007 PMOS
M23 N015 g2 N011 N011 PMOS
M24 N015 g1 N011 N011 PMOS
M25 N015 b0 N011 N011 PMOS
M26 N013 N002 N015 N015 PMOS
M27 N013 N003 N015 N015 PMOS
M28 N013 b0 N015 N015 PMOS
M29 N013 N004 P007 P007 NMOS
M30 P007 N003 P008 P008 NMOS
M31 P008 g2 0 0 NMOS
M33 N013 N004 P009 P009 NMOS
M34 P009 g1 P010 P010 NMOS
M35 P010 N002 0 0 NMOS
M37 N013 g2 P011 P011 NMOS
M38 P011 g1 P012 P012 NMOS
M39 P012 b0 0 0 NMOS
M41 N013 N002 P013 P013 NMOS
M42 P013 N003 P014 P014 NMOS
M32 P014 b0 0 0 NMOS
M36 b2 N013 P015 P015 PMOS
M40 b2 N013 0 0 NMOS
V9 P015 0 5
M43 N001 g3 P016 P016 PMOS
M44 N010 N004 N009 N009 PMOS
M45 N001 g3 0 0 NMOS
M46 N019 N004 P017 P017 NMOS
V11 g3 0 PULSE(5 0 0 1n 1n 10m 20m)
V12 P016 0 5
M47 N010 N003 N009 N009 PMOS
M48 N010 N002 N009 N009 PMOS
M49 N010 g3 N009 N009 PMOS
M50 N014 N004 N010 N010 PMOS
M51 N014 N003 N010 N010 PMOS
M52 N014 g2 N010 N010 PMOS
M53 N014 N001 N010 N010 PMOS
M54 N016 g1 N014 N014 PMOS
M55 N016 N002 N014 N014 PMOS
M56 N016 N001 N014 N014 PMOS
M57 N016 N004 N014 N014 PMOS
M58 N017 N004 N016 N016 PMOS
M59 N017 g1 N016 N016 PMOS
M60 N017 g2 N016 N016 PMOS
M61 N017 g3 N016 N016 PMOS
M62 P017 N003 P018 P018 NMOS
M63 P018 N002 P019 P019 NMOS
M64 P019 g3 0 0 NMOS
M65 N019 N004 P020 P020 NMOS
M66 P020 N003 P021 P021 NMOS
M67 P021 g2 P022 P022 NMOS
M68 P022 N001 0 0 NMOS
M69 N019 g1 P023 P023 NMOS
M70 P023 N002 P024 P024 NMOS
M71 P024 N001 P025 P025 NMOS
M72 P025 N004 0 0 NMOS
M73 N019 N004 P026 P026 NMOS
M74 P026 g1 P027 P027 NMOS
M75 P027 g2 P028 P028 NMOS
M76 P028 g3 0 0 NMOS
M77 N018 b0 N017 N017 PMOS
M78 N018 g1 N017 N017 PMOS
M79 N018 N002 N017 N017 PMOS
M80 N018 g3 N017 N017 PMOS
M81 N020 b0 N018 N018 PMOS
M82 N020 g1 N018 N018 PMOS
M83 N020 g2 N018 N018 PMOS
M84 N020 N001 N018 N018 PMOS
M85 N021 b0 N020 N020 PMOS
M86 N021 N003 N020 N020 PMOS
M87 N021 N002 N020 N020 PMOS
M88 N021 N001 N020 N020 PMOS
M89 N019 b0 N021 N021 PMOS
M90 N019 N003 N021 N021 PMOS
M91 N019 g2 N021 N021 PMOS
M92 N019 g3 N021 N021 PMOS
M93 N019 b0 P029 P029 NMOS
M94 P029 g1 P030 P030 NMOS
M95 P030 N002 P031 P031 NMOS
M96 P031 g3 0 0 NMOS
M97 N019 b0 P032 P032 NMOS
M98 P032 g1 P033 P033 NMOS
M99 P033 g2 P034 P034 NMOS
M100 P034 N001 0 0 NMOS
M101 N019 b0 P035 P035 NMOS
M102 P035 N003 P036 P036 NMOS
M103 P036 N002 P037 P037 NMOS
M104 P037 N001 0 0 NMOS
M105 N019 b0 P038 P038 NMOS
M106 P038 N003 P039 P039 NMOS
M107 P039 g2 P040 P040 NMOS
M108 P040 g3 0 0 NMOS
M109 b3 N019 P041 P041 PMOS
M110 b3 N019 0 0 NMOS
V13 P041 0 5
V10 N005 0 5
V5 N006 0 5
V14 N009 0 5
M12 P004 N003 0 0 NMOS
.model NMOS NMOS
.model PMOS PMOS
.lib standard.mos
.tran 360m
.backanno
.end